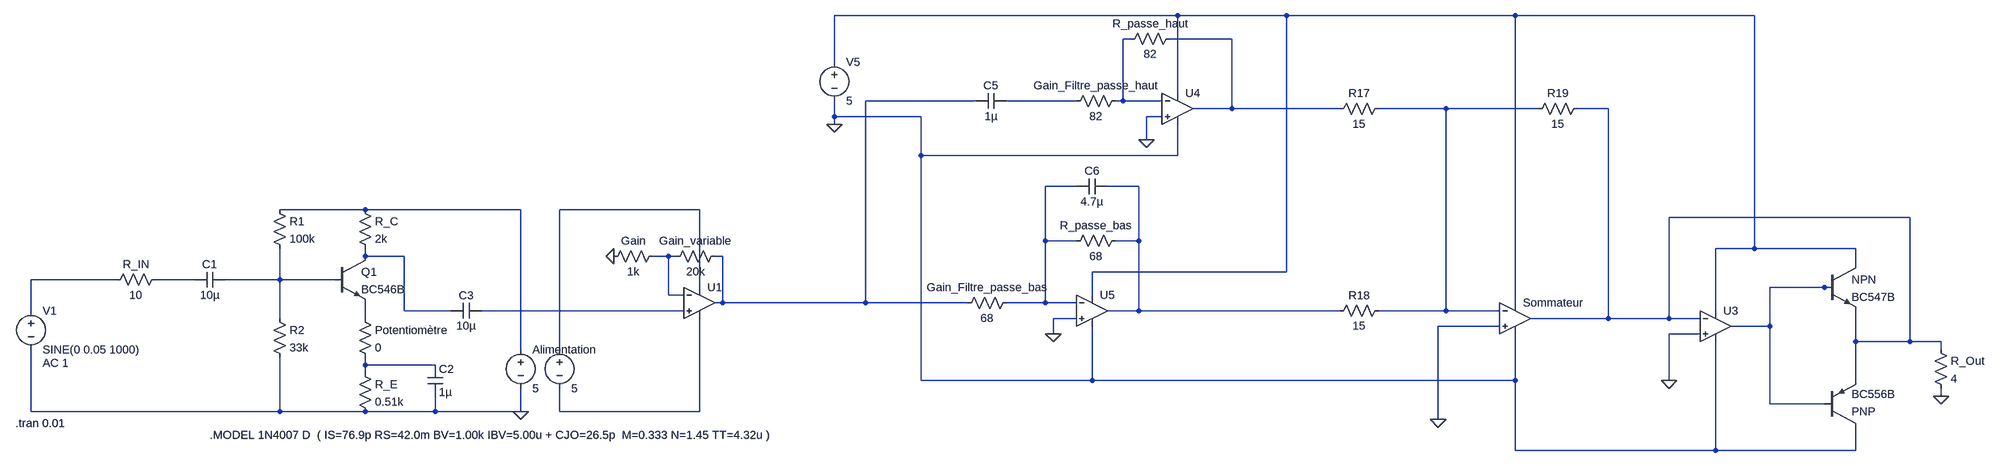
[diagram p0: schematic Livrable N°3 Circuit Complet.asc]
Livrable N°3 Circuit Complet.asc, the LTspice schematic file:
Version 4
SHEET 1 4484 680
WIRE 2272 -416 1552 -416
WIRE 2496 -416 2272 -416
WIRE 3152 -416 2496 -416
WIRE 3808 -416 3152 -416
WIRE 2176 -368 2160 -368
WIRE 2384 -368 2256 -368
WIRE 1552 -320 1552 -416
WIRE 2272 -256 2272 -416
WIRE 1856 -240 1616 -240
WIRE 2064 -240 1920 -240
WIRE 2160 -240 2160 -368
WIRE 2160 -240 2144 -240
WIRE 2240 -240 2160 -240
WIRE 2384 -224 2384 -368
WIRE 2384 -224 2304 -224
WIRE 2736 -224 2384 -224
WIRE 2976 -224 2816 -224
WIRE 3200 -224 2976 -224
WIRE 3344 -224 3280 -224
WIRE 1552 -208 1552 -240
WIRE 1744 -208 1552 -208
WIRE 2240 -208 2208 -208
WIRE 1552 -192 1552 -208
WIRE 2208 -160 2208 -208
WIRE 1744 -128 1744 -208
WIRE 2272 -128 2272 -192
WIRE 2272 -128 1744 -128
WIRE 2064 -64 2000 -64
WIRE 2192 -64 2128 -64
WIRE 528 -16 352 -16
WIRE 848 -16 528 -16
WIRE 1216 -16 928 -16
WIRE 4128 0 3632 0
WIRE 2000 48 2000 -64
WIRE 2064 48 2000 48
WIRE 2192 48 2192 -64
WIRE 2192 48 2144 48
WIRE 3808 64 3808 -416
WIRE 3808 64 3728 64
WIRE 4016 64 3808 64
WIRE 528 80 528 64
WIRE 608 80 528 80
WIRE 1152 80 1120 80
WIRE 1168 80 1152 80
WIRE 1264 80 1248 80
WIRE 4016 96 4016 64
WIRE 2496 112 2496 -416
WIRE 2496 112 2096 112
WIRE 16 128 -160 128
WIRE 176 128 96 128
WIRE 352 128 352 64
WIRE 352 128 240 128
WIRE 464 128 352 128
WIRE 1216 144 1216 -16
WIRE 3952 144 3840 144
WIRE 3968 144 3952 144
WIRE 1152 160 1152 80
WIRE 1184 160 1152 160
WIRE 2096 160 2096 112
WIRE 1264 176 1264 80
WIRE 1264 176 1248 176
WIRE 1616 176 1616 -240
WIRE 1616 176 1264 176
WIRE 1840 176 1616 176
WIRE 2000 176 2000 48
WIRE 2000 176 1920 176
WIRE 2064 176 2000 176
WIRE 3152 176 3152 -416
WIRE -160 192 -160 128
WIRE 608 192 608 80
WIRE 704 192 608 192
WIRE 1184 192 768 192
WIRE 2192 192 2192 48
WIRE 2192 192 2128 192
WIRE 2736 192 2192 192
WIRE 2976 192 2976 -224
WIRE 2976 192 2816 192
WIRE 3120 192 2976 192
WIRE 3728 192 3728 64
WIRE 352 208 352 128
WIRE 528 208 528 176
WIRE 2064 208 2016 208
WIRE 3344 208 3344 -224
WIRE 3344 208 3184 208
WIRE 3632 208 3632 0
WIRE 3632 208 3344 208
WIRE 3696 208 3632 208
WIRE 3120 224 2960 224
WIRE 3840 224 3840 144
WIRE 3840 224 3760 224
WIRE 2016 240 2016 208
WIRE 3696 240 3632 240
WIRE 4016 256 4016 192
WIRE 4128 256 4128 0
WIRE 4128 256 4016 256
WIRE 4192 256 4128 256
WIRE 848 272 848 -16
WIRE 928 272 928 -16
WIRE 4192 272 4192 256
WIRE 528 304 528 288
WIRE 672 304 528 304
WIRE 528 320 528 304
WIRE 1744 336 1744 -128
WIRE 2096 336 2096 224
WIRE 2096 336 1744 336
WIRE 3152 336 3152 240
WIRE 3152 336 2096 336
WIRE 3632 336 3632 240
WIRE 4016 336 4016 256
WIRE 4192 368 4192 352
WIRE 3840 384 3840 224
WIRE 3952 384 3840 384
WIRE -160 400 -160 272
WIRE 352 400 352 288
WIRE 352 400 -160 400
WIRE 528 400 352 400
WIRE 672 400 672 368
WIRE 672 400 528 400
WIRE 848 400 848 352
WIRE 848 400 672 400
WIRE 928 400 928 352
WIRE 1216 400 1216 208
WIRE 1216 400 928 400
WIRE 2960 416 2960 224
WIRE 3152 480 3152 336
WIRE 3728 480 3728 256
WIRE 3728 480 3152 480
WIRE 4016 480 4016 432
WIRE 4016 480 3728 480
FLAG 1040 80 0
FLAG 848 400 0
FLAG 4192 368 0
FLAG 2016 240 0
FLAG 2208 -160 0
FLAG 1552 -192 0
FLAG 2960 416 0
FLAG 3632 336 0
SYMBOL res 112 112 R90
WINDOW 0 0 56 VBottom 2
WINDOW 3 32 56 VTop 2
SYMATTR InstName R_IN
SYMATTR Value 10
SYMBOL cap 240 112 R90
WINDOW 0 0 32 VBottom 2
WINDOW 3 32 32 VTop 2
SYMATTR InstName C1
SYMATTR Value 10µ
SYMBOL res 336 -32 R0
SYMATTR InstName R1
SYMATTR Value 100k
SYMBOL res 336 192 R0
SYMATTR InstName R2
SYMATTR Value 33k
SYMBOL res 512 -32 R0
SYMATTR InstName R_C
SYMATTR Value 2k
SYMBOL res 512 192 R0
SYMATTR InstName Potentiomètre
SYMATTR Value 0
SYMBOL res 512 304 R0
SYMATTR InstName R_E
SYMATTR Value 0.51k
SYMBOL voltage -160 176 R0
WINDOW 123 24 124 Left 2
WINDOW 39 0 0 Left 0
SYMATTR Value2 AC 1
SYMATTR InstName V1
SYMATTR Value SINE(0 0.05 1000)
SYMBOL npn 464 80 R0
SYMATTR InstName Q1
SYMATTR Value BC546B
SYMBOL cap 656 304 R0
SYMATTR InstName C2
SYMATTR Value 1µ
SYMBOL res 1136 64 R90
WINDOW 0 0 56 VBottom 2
WINDOW 3 32 56 VTop 2
SYMATTR InstName Gain
SYMATTR Value 1k
SYMBOL res 1264 64 R90
WINDOW 0 0 56 VBottom 2
WINDOW 3 32 56 VTop 2
SYMATTR InstName Gain_variable
SYMATTR Value 20k
SYMBOL OpAmps\\UniversalOpAmp 1216 176 R0
SYMATTR InstName U1
SYMBOL cap 768 176 R90
WINDOW 0 0 32 VBottom 2
WINDOW 3 32 32 VTop 2
SYMATTR InstName C3
SYMATTR Value 10µ
SYMBOL voltage 848 256 R0
SYMATTR InstName Alimentation
SYMATTR Value 5
SYMBOL voltage 928 256 R0
SYMATTR InstName .
SYMATTR Value 5
SYMBOL pnp 3952 432 M180
SYMATTR InstName PNP
SYMATTR Value BC556B
SYMBOL npn 3952 96 R0
SYMATTR InstName NPN
SYMATTR Value BC547B
SYMBOL OpAmps\\UniversalOpAmp 3728 224 R0
SYMATTR InstName U3
SYMBOL res 4176 256 R0
SYMATTR InstName R_Out
SYMATTR Value 4
SYMBOL cap 1920 -256 R90
WINDOW 0 0 32 VBottom 2
WINDOW 3 32 32 VTop 2
SYMATTR InstName C5
SYMATTR Value 1µ
SYMBOL res 2160 -256 R90
WINDOW 0 0 56 VBottom 2
WINDOW 3 32 56 VTop 2
SYMATTR InstName Gain_Filtre_passe_haut
SYMATTR Value 82
SYMBOL OpAmps\\UniversalOpAmp 2272 -224 R0
SYMATTR InstName U4
SYMBOL res 2272 -384 R90
WINDOW 0 0 56 VBottom 2
WINDOW 3 32 56 VTop 2
SYMATTR InstName R_passe_haut
SYMATTR Value 82
SYMBOL OpAmps\\UniversalOpAmp 2096 192 R0
SYMATTR InstName U5
SYMBOL res 2160 32 R90
WINDOW 0 0 56 VBottom 2
WINDOW 3 32 56 VTop 2
SYMATTR InstName R_passe_bas
SYMATTR Value 68
SYMBOL cap 2128 -80 R90
WINDOW 0 0 32 VBottom 2
WINDOW 3 32 32 VTop 2
SYMATTR InstName C6
SYMATTR Value 4.7µ
SYMBOL voltage 1552 -336 R0
WINDOW 123 0 0 Left 0
WINDOW 39 0 0 Left 0
SYMATTR InstName V5
SYMATTR Value 5
SYMBOL res 1936 160 R90
WINDOW 0 0 56 VBottom 2
WINDOW 3 32 56 VTop 2
SYMATTR InstName Gain_Filtre_passe_bas
SYMATTR Value 68
SYMBOL res 2832 -240 R90
WINDOW 0 0 56 VBottom 2
WINDOW 3 32 56 VTop 2
SYMATTR InstName R17
SYMATTR Value 15
SYMBOL res 2832 176 R90
WINDOW 0 0 56 VBottom 2
WINDOW 3 32 56 VTop 2
SYMATTR InstName R18
SYMATTR Value 15
SYMBOL res 3296 -240 R90
WINDOW 0 0 56 VBottom 2
WINDOW 3 32 56 VTop 2
SYMATTR InstName R19
SYMATTR Value 15
SYMBOL OpAmps\\UniversalOpAmp 3152 208 R0
SYMATTR InstName Sommateur
TEXT -192 424 Left 2 !.tran 0.01
TEXT 208 448 Left 2 !.MODEL 1N4007 D  ( IS=76.9p RS=42.0m BV=1.00k IBV=5.00u + CJO=26.5p  M=0.333 N=1.45 TT=4.32u )

The netlist it stands for:
* Livrable N°3 Circuit Complet.asc
R_IN N015 N014 10
C1 N016 N015 10µ
R1 N010 N016 100k
R2 N016 0 33k
R_C N010 N012 2k
R§Potentiomètre N019 N020 0
R_E N020 0 0.51k
V1 N014 0 SINE(0 0.05 1000) AC 1
Q1 N012 N016 N019 0 BC546B
C2 N020 0 1µ
R§Gain N013 0 1k
R§Gain_variable N004 N013 20k
XU1 N018 N013 N011 N021 N004 level1 Avol=1Meg GBW=10Meg Vos=0 En=0 Enk=0 In=0 Ink=0 Rin=500Meg  ; pins In+ In- V+ V- OUT
C3 N018 N012 10µ
V§Alimentation N010 0 5
V§. N011 N021 5
Q§PNP 0 N017 N007 0 BC556B
Q§NPN N001 N017 N007 0 BC547B
XU3 0 N007 N001 0 N017 level1 Avol=1Meg GBW=10Meg Vos=0 En=0 Enk=0 In=0 Ink=0 Rin=500Meg  ; pins In+ In- V+ V- OUT
R_Out N007 0 4
C5 N005 N004 1µ
R§Gain_Filtre_passe_haut N002 N005 82
XU4 0 N002 N001 0 N003 level1 Avol=1Meg GBW=10Meg Vos=0 En=0 Enk=0 In=0 Ink=0 Rin=500Meg  ; pins In+ In- V+ V- OUT
R_passe_haut N003 N002 82
XU5 0 N008 N001 0 N009 level1 Avol=1Meg GBW=10Meg Vos=0 En=0 Enk=0 In=0 Ink=0 Rin=500Meg  ; pins In+ In- V+ V- OUT
R_passe_bas N009 N008 68
C6 N009 N008 4.7µ
V5 N001 0 5
R§Gain_Filtre_passe_bas N008 N004 68
R17 N006 N003 15
R18 N006 N009 15
R19 N007 N006 15
XSommateur 0 N006 N001 0 N007 level1 Avol=1Meg GBW=10Meg Vos=0 En=0 Enk=0 In=0 Ink=0 Rin=500Meg  ; pins In+ In- V+ V- OUT
.model NPN NPN
.model PNP PNP
.lib standard.bjt
.tran 0.01
.MODEL 1N4007 D  ( IS=76.9p RS=42.0m BV=1.00k IBV=5.00u + CJO=26.5p  M=0.333 N=1.45 TT=4.32u )
.lib UniversalOpAmp1.lib
.backanno
.end